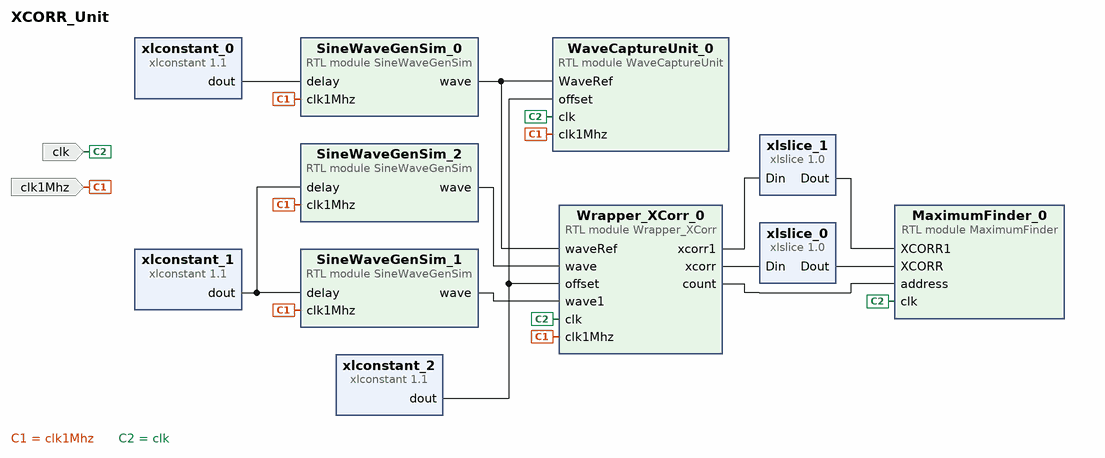
[diagram p0: block diagram of the top level]
# Vivado block design XCORR_Unit, xc7z020clg400-1, Vivado 2024.2
create_bd_design XCORR_Unit

create_bd_port -dir I -type clk clk
create_bd_port -dir I clk1Mhz

create_bd_cell -type ip -vlnv xilinx.com:ip:xlconstant:1.1 xlconstant_0
set_property -dict {CONFIG.CONST_VAL 0 CONFIG.CONST_WIDTH 32} [get_bd_cells xlconstant_0]
create_bd_cell -type ip -vlnv xilinx.com:ip:xlconstant:1.1 xlconstant_2
set_property -dict {CONFIG.CONST_VAL 0 CONFIG.CONST_WIDTH 32} [get_bd_cells xlconstant_2]
create_bd_cell -type module -reference WaveCaptureUnit WaveCaptureUnit_0
create_bd_cell -type module -reference Wrapper_XCorr Wrapper_XCorr_0
create_bd_cell -type module -reference SineWaveGenSim SineWaveGenSim_0
create_bd_cell -type module -reference SineWaveGenSim SineWaveGenSim_1
create_bd_cell -type module -reference SineWaveGenSim SineWaveGenSim_2
create_bd_cell -type module -reference MaximumFinder MaximumFinder_0
create_bd_cell -type ip -vlnv xilinx.com:ip:xlslice:1.0 xlslice_0
set_property -dict {CONFIG.DIN_FROM 35 CONFIG.DIN_TO 4 CONFIG.DIN_WIDTH 36 CONFIG.DOUT_WIDTH 32} [get_bd_cells xlslice_0]
create_bd_cell -type ip -vlnv xilinx.com:ip:xlslice:1.0 xlslice_1
set_property -dict {CONFIG.DIN_FROM 35 CONFIG.DIN_TO 4 CONFIG.DIN_WIDTH 36 CONFIG.DOUT_WIDTH 32} [get_bd_cells xlslice_1]
create_bd_cell -type ip -vlnv xilinx.com:ip:xlconstant:1.1 xlconstant_1
set_property -dict {CONFIG.CONST_VAL 10 CONFIG.CONST_WIDTH 32} [get_bd_cells xlconstant_1]

# ---- connections ----

connect_bd_net [get_bd_pins SineWaveGenSim_1/wave] [get_bd_pins Wrapper_XCorr_0/wave1]
connect_bd_net [get_bd_pins SineWaveGenSim_2/wave] [get_bd_pins Wrapper_XCorr_0/wave]
connect_bd_net -net SineWaveGen_0_wave [get_bd_pins SineWaveGenSim_0/wave] \
  [get_bd_pins WaveCaptureUnit_0/WaveRef] [get_bd_pins Wrapper_XCorr_0/waveRef]
connect_bd_net [get_bd_pins Wrapper_XCorr_0/count] [get_bd_pins MaximumFinder_0/address]
connect_bd_net [get_bd_pins Wrapper_XCorr_0/xcorr] [get_bd_pins xlslice_0/Din]
connect_bd_net [get_bd_pins Wrapper_XCorr_0/xcorr1] [get_bd_pins xlslice_1/Din]
connect_bd_net -net clk1Mhz_0_1 [get_bd_ports clk1Mhz] \
  [get_bd_pins SineWaveGenSim_0/clk1Mhz] [get_bd_pins SineWaveGenSim_1/clk1Mhz] [get_bd_pins SineWaveGenSim_2/clk1Mhz] \
  [get_bd_pins WaveCaptureUnit_0/clk1Mhz] [get_bd_pins Wrapper_XCorr_0/clk1Mhz]
connect_bd_net [get_bd_ports clk] [get_bd_pins MaximumFinder_0/clk] [get_bd_pins WaveCaptureUnit_0/clk] [get_bd_pins Wrapper_XCorr_0/clk]
connect_bd_net [get_bd_pins xlconstant_0/dout] [get_bd_pins SineWaveGenSim_0/delay]
connect_bd_net [get_bd_pins xlconstant_1/dout] [get_bd_pins SineWaveGenSim_1/delay] [get_bd_pins SineWaveGenSim_2/delay]
connect_bd_net [get_bd_pins xlconstant_2/dout] [get_bd_pins WaveCaptureUnit_0/offset] [get_bd_pins Wrapper_XCorr_0/offset]
connect_bd_net [get_bd_pins xlslice_0/Dout] [get_bd_pins MaximumFinder_0/XCORR]
connect_bd_net [get_bd_pins xlslice_1/Dout] [get_bd_pins MaximumFinder_0/XCORR1]

validate_bd_design
save_bd_design
